# Altium project Miner_8TH.PrjPcb (part 2 of 2)

## Sheet BLOCK8.SchDoc
size A3; SheetNumber: 8; SheetTotal: 12
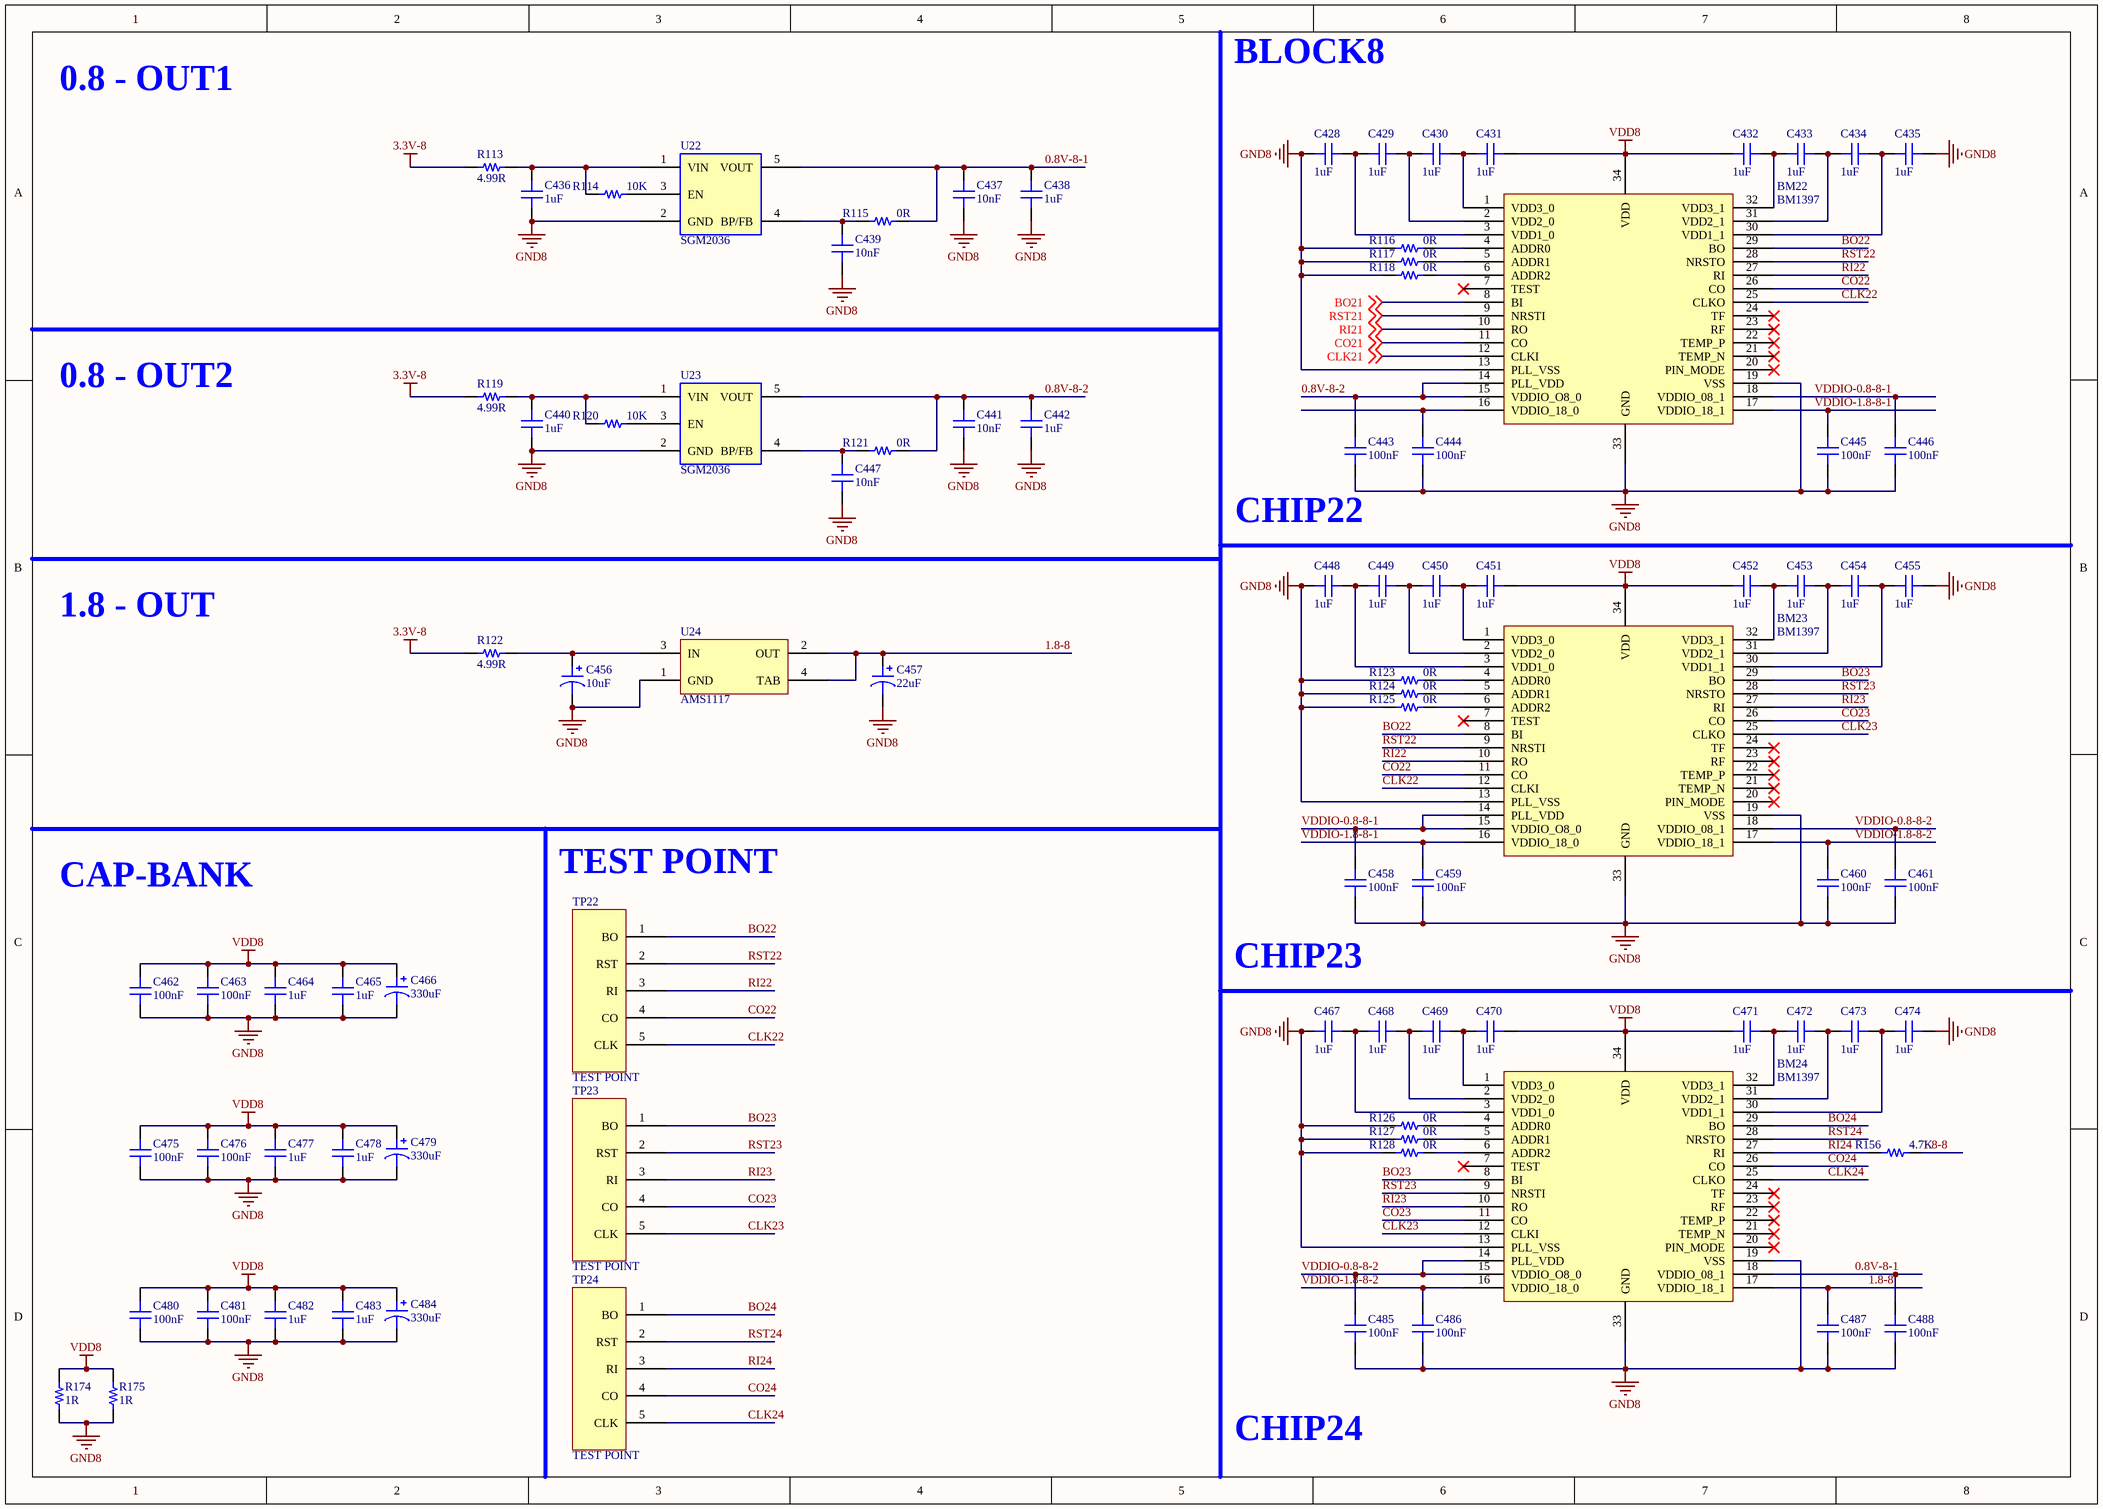
[diagram p7: BLOCK8.SchDoc]

### Parts
BM22  BM1397  [BM1387]
BM23  BM1397  [BM1387]
BM24  BM1397  [BM1387]
C428  1uF  [CAP-SMD-0603]
C429  1uF  [CAP-SMD-0603]
C430  1uF  [CAP-SMD-0603]
C431  1uF  [CAP-SMD-0603]
C432  1uF  [CAP-SMD-0603]
C433  1uF  [CAP-SMD-0603]
C434  1uF  [CAP-SMD-0603]
C435  1uF  [CAP-SMD-0603]
C436  1uF  [CAP_SMD_0805]
C437  10nF  [CAP_SMD_0805]
C438  1uF  [CAP_SMD_0805]
C439  10nF  [CAP_SMD_0805]
C440  1uF  [CAP_SMD_0805]
C441  10nF  [CAP_SMD_0805]
C442  1uF  [CAP_SMD_0805]
C443  100nF  [CAP_SMD_0805]
C444  100nF  [CAP_SMD_0805]
C445  100nF  [CAP_SMD_0805]
C446  100nF  [CAP_SMD_0805]
C447  10nF  [CAP_SMD_0805]
C448  1uF  [CAP-SMD-0603]
C449  1uF  [CAP-SMD-0603]
C450  1uF  [CAP-SMD-0603]
C451  1uF  [CAP-SMD-0603]
C452  1uF  [CAP-SMD-0603]
C453  1uF  [CAP-SMD-0603]
C454  1uF  [CAP-SMD-0603]
C455  1uF  [CAP-SMD-0603]
C456  10uF  [CAP-TAN-CASE-A]
C457  22uF  [CAP-TAN-CASE-A]
C458  100nF  [CAP_SMD_0805]
C459  100nF  [CAP_SMD_0805]
C460  100nF  [CAP_SMD_0805]
C461  100nF  [CAP_SMD_0805]
C462  100nF  [CAP_SMD_0805]
C463  100nF  [CAP_SMD_0805]
C464  1uF  [CAP_SMD_0805]
C465  1uF  [CAP_SMD_0805]
C466  330uF  [CAP-TAN-CASE-E]
C467  1uF  [CAP-SMD-0603]
C468  1uF  [CAP-SMD-0603]
C469  1uF  [CAP-SMD-0603]
C470  1uF  [CAP-SMD-0603]
C471  1uF  [CAP-SMD-0603]
C472  1uF  [CAP-SMD-0603]
C473  1uF  [CAP-SMD-0603]
C474  1uF  [CAP-SMD-0603]
C475  100nF  [CAP_SMD_0805]
C476  100nF  [CAP_SMD_0805]
C477  1uF  [CAP_SMD_0805]
C478  1uF  [CAP_SMD_0805]
C479  330uF  [CAP-TAN-CASE-E]
C480  100nF  [CAP_SMD_0805]
C481  100nF  [CAP_SMD_0805]
C482  1uF  [CAP_SMD_0805]
C483  1uF  [CAP_SMD_0805]
C484  330uF  [CAP-TAN-CASE-E]
C485  100nF  [CAP_SMD_0805]
C486  100nF  [CAP_SMD_0805]
C487  100nF  [CAP_SMD_0805]
C488  100nF  [CAP_SMD_0805]
R113  4.99R  [RES-SMD-1206]
R114  10K  [RES-SMD-0402]
R115  0R  [RES-SMD-0402]
R116  0R  [RES-SMD-0402]
R117  0R  [RES-SMD-0402]
R118  0R  [RES-SMD-0402]
R119  4.99R  [RES-SMD-1206]
R120  10K  [RES-SMD-0402]
R121  0R  [RES-SMD-0402]
R122  4.99R  [RES-SMD-1206]
R123  0R  [RES-SMD-0402]
R124  0R  [RES-SMD-0402]
R125  0R  [RES-SMD-0402]
R126  0R  [RES-SMD-0402]
R127  0R  [RES-SMD-0402]
R128  0R  [RES-SMD-0402]
R156  4.7K  [RES-SMD-0402]
R174  1R  [RES-SMD-1210]
R175  1R  [RES-SMD-1210]
TP22  TEST POINT  [TEST_POINT]
TP23  TEST POINT  [TEST_POINT]
TP24  TEST POINT  [TEST_POINT]
U22  SGM2036  [SOT23-5PIN]
U23  SGM2036  [SOT23-5PIN]
U24  AMS1117  [AMS1117]

### Nets
3.3V-8: R113.1 R119.1 R122.1
GND8: BM22.13(PLL_VSS) BM22.19(VSS) BM22.33(GND) BM23.13(PLL_VSS) BM23.19(VSS) BM23.33(GND) BM24.13(PLL_VSS) BM24.19(VSS) BM24.33(GND) C428.1 C435.2 C436.1 C437.1 C438.1 C439.1 C440.1 C441.1 C442.1 C443.1 C444.1 C445.1 C446.1 C447.1 C448.1 C455.2 C456.2 C457.2 C458.1 C459.1 C460.1 C461.1 C462.1 C463.1 C464.1 C465.1 C466.2 C467.1 C474.2 C475.1 C476.1 C477.1 C478.1 C479.2 C480.1 C481.1 C482.1 C483.1 C484.2 C485.1 C486.1 C487.1 C488.1 R116.1 R117.1 R118.1 R123.1 R124.1 R125.1 R126.1 R127.1 R128.1 R174.1 R175.1 U22.2(GND) U23.2(GND) U24.1(GND)  [project net 3.3V-6]
VDD8: BM22.34(VDD) BM23.34(VDD) BM24.34(VDD) C431.2 C432.1 C451.2 C452.1 C462.2 C463.2 C464.2 C465.2 C466.1 C470.2 C471.1 C475.2 C476.2 C477.2 C478.2 C479.1 C480.2 C481.2 C482.2 C483.2 C484.1 R174.2 R175.2  [project net 12V]
0.8V-8-1: BM24.18(VDDIO_08_1) C437.2 C438.2 C488.2 R115.2 U22.5(VOUT)
0.8V-8-2: BM22.14(PLL_VDD) BM22.15(VDDIO_O8_0) C441.2 C442.2 C443.2 R121.2 U23.5(VOUT)
1.8-8: BM24.17(VDDIO_18_1) C457.1 C487.2 R156.2 U24.2(OUT) U24.4(TAB)
BO21: BM22.8(BI) ; off-sheet BO21
BO22: BM22.29(BO) BM23.8(BI) TP22.1(BO)
BO23: BM23.29(BO) BM24.8(BI) TP23.1(BO)
BO24: BM24.29(BO) TP24.1(BO)
CLK21: BM22.12(CLKI) ; off-sheet CLK21
CLK22: BM22.25(CLKO) BM23.12(CLKI) TP22.5(CLK)
CLK23: BM23.25(CLKO) BM24.12(CLKI) TP23.5(CLK)
CLK24: BM24.25(CLKO) TP24.5(CLK)
CO21: BM22.11(CO) ; off-sheet CO21
CO22: BM22.26(CO) BM23.11(CO) TP22.4(CO)
CO23: BM23.26(CO) BM24.11(CO) TP23.4(CO)
CO24: BM24.26(CO) TP24.4(CO)
RI21: BM22.10(RO) ; off-sheet RI21
RI22: BM22.27(RI) BM23.10(RO) TP22.3(RI)
RI23: BM23.27(RI) BM24.10(RO) TP23.3(RI)
RI24: BM24.27(RI) R156.1 TP24.3(RI)
RST21: BM22.9(NRSTI) ; off-sheet RST21
RST22: BM22.28(NRSTO) BM23.9(NRSTI) TP22.2(RST)
RST23: BM23.28(NRSTO) BM24.9(NRSTI) TP23.2(RST)
RST24: BM24.28(NRSTO) TP24.2(RST)
VDDIO-0.8-8-1: BM22.18(VDDIO_08_1) BM23.14(PLL_VDD) BM23.15(VDDIO_O8_0) C446.2 C458.2
VDDIO-0.8-8-2: BM23.18(VDDIO_08_1) BM24.14(PLL_VDD) BM24.15(VDDIO_O8_0) C461.2 C485.2
VDDIO-1.8-8-1: BM22.17(VDDIO_18_1) BM23.16(VDDIO_18_0) C445.2 C459.2
VDDIO-1.8-8-2: BM23.17(VDDIO_18_1) BM24.16(VDDIO_18_0) C460.2 C486.2
NetBM22_1: BM22.1(VDD3_0) C430.2 C431.1
NetBM22_2: BM22.2(VDD2_0) C429.2 C430.1
NetBM22_3: BM22.3(VDD1_0) C428.2 C429.1
NetBM22_4: BM22.4(ADDR0) R116.2
NetBM22_5: BM22.5(ADDR1) R117.2
NetBM22_6: BM22.6(ADDR2) R118.2
NetBM22_16: BM22.16(VDDIO_18_0) C444.2
NetBM22_30: BM22.30(VDD1_1) C434.2 C435.1
NetBM22_31: BM22.31(VDD2_1) C433.2 C434.1
NetBM22_32: BM22.32(VDD3_1) C432.2 C433.1
NetBM23_1: BM23.1(VDD3_0) C450.2 C451.1
NetBM23_2: BM23.2(VDD2_0) C449.2 C450.1
NetBM23_3: BM23.3(VDD1_0) C448.2 C449.1
NetBM23_4: BM23.4(ADDR0) R123.2
NetBM23_5: BM23.5(ADDR1) R124.2
NetBM23_6: BM23.6(ADDR2) R125.2
NetBM23_30: BM23.30(VDD1_1) C454.2 C455.1
NetBM23_31: BM23.31(VDD2_1) C453.2 C454.1
NetBM23_32: BM23.32(VDD3_1) C452.2 C453.1
NetBM24_1: BM24.1(VDD3_0) C469.2 C470.1
NetBM24_2: BM24.2(VDD2_0) C468.2 C469.1
NetBM24_3: BM24.3(VDD1_0) C467.2 C468.1
NetBM24_4: BM24.4(ADDR0) R126.2
NetBM24_5: BM24.5(ADDR1) R127.2
NetBM24_6: BM24.6(ADDR2) R128.2
NetBM24_30: BM24.30(VDD1_1) C473.2 C474.1
NetBM24_31: BM24.31(VDD2_1) C472.2 C473.1
NetBM24_32: BM24.32(VDD3_1) C471.2 C472.1
NetC436_2: C436.2 R113.2 R114.1 U22.1(VIN)
NetC439_2: C439.2 R115.1 U22.4(BP/FB)
NetC440_2: C440.2 R119.2 R120.1 U23.1(VIN)
NetC447_2: C447.2 R121.1 U23.4(BP/FB)
NetC456_1: C456.1 R122.2 U24.3(IN)
NetR114_2: R114.2 U22.3(EN)
NetR120_2: R120.2 U23.3(EN)

Not connected (* = marked no-connect by the designer): BM22 7(TEST)* 20(PIN_MODE)* 21(TEMP_N)* 22(TEMP_P)* 23(RF)* 24(TF)*; BM23 7(TEST)* 20(PIN_MODE)* 21(TEMP_N)* 22(TEMP_P)* 23(RF)* 24(TF)*; BM24 7(TEST)* 20(PIN_MODE)* 21(TEMP_N)* 22(TEMP_P)* 23(RF)* 24(TF)*

### Notes on the sheet
- 0.8 - OUT1
- BLOCK8
- 0.8 - OUT2
- (near C443) CHIP22
- 1.8 - OUT
- CAP-BANK
- TEST POINT
- CHIP23
- CHIP24

### Library data of the parts
BM22-BM24 = BM1397_1
C428-C455 C458-C465 C467-C478 C480-C483 C485-C488 = CAP
C456 C457 C466 C479 C484 = POLARIZED CAP
R113-R128 R156 R174 R175 = RES

## Sheet Prepheral.SchDoc
size A4; SheetNumber: 9; SheetTotal: 12
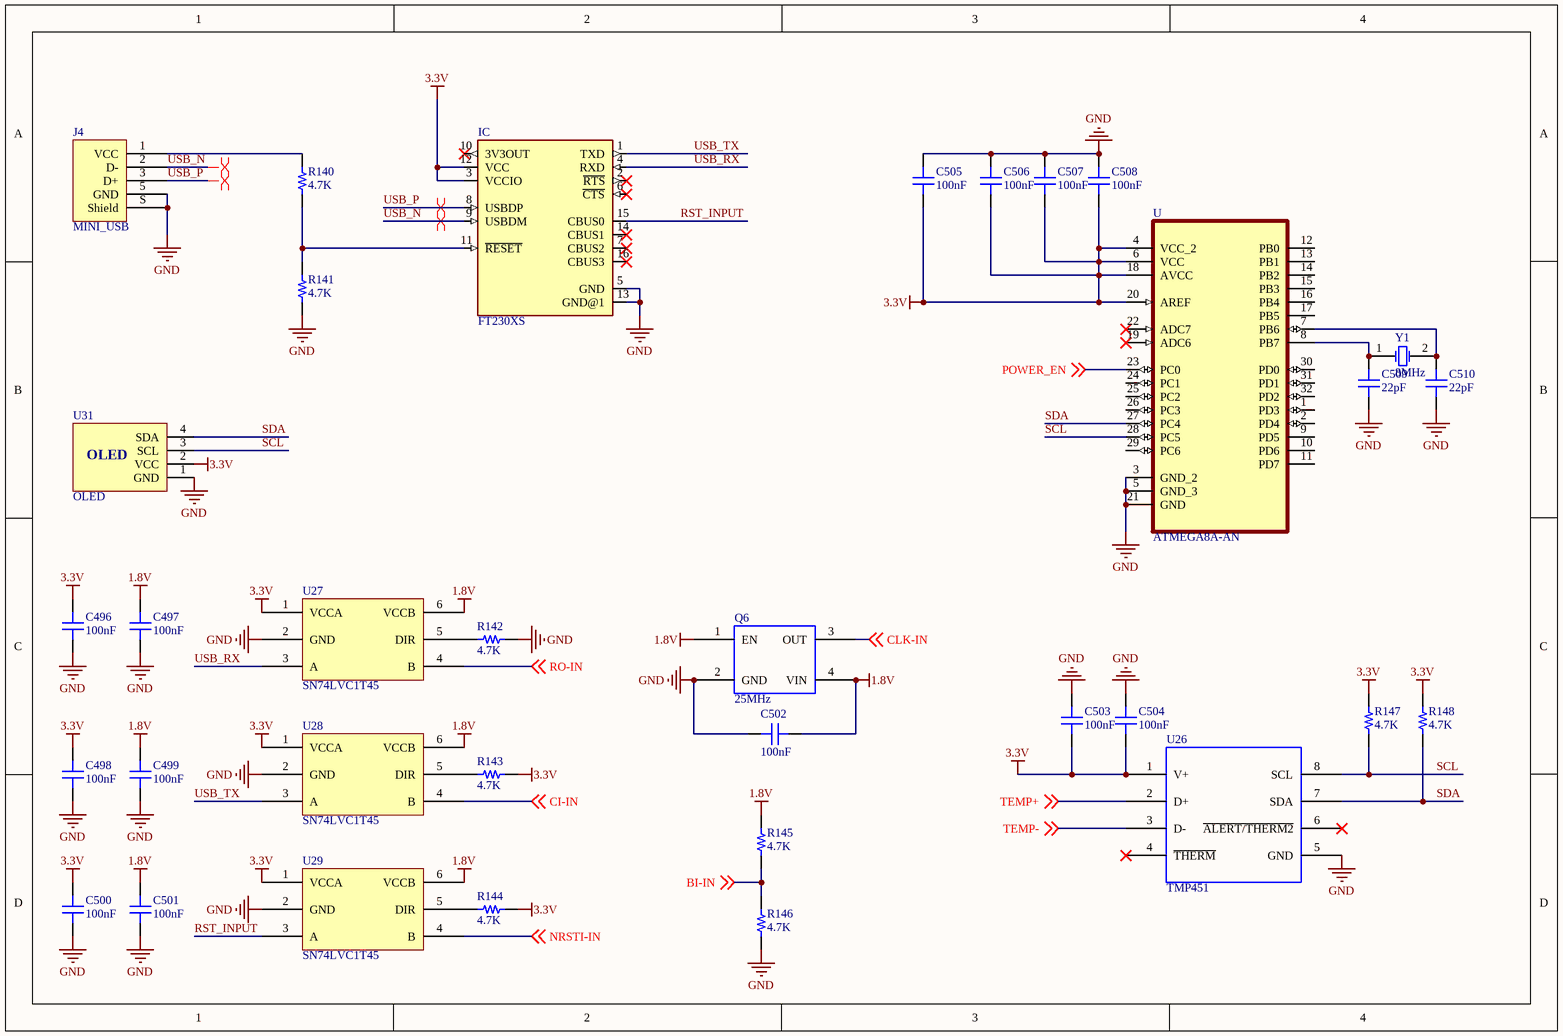
[diagram p8: Prepheral.SchDoc]

### Parts
C496  100nF  [CAP-SMD-0603]
C497  100nF  [CAP-SMD-0603]
C498  100nF  [CAP-SMD-0603]
C499  100nF  [CAP-SMD-0603]
C500  100nF  [CAP-SMD-0603]
C501  100nF  [CAP-SMD-0603]
C502  100nF  [CAP_SMD_0805]
C503  100nF  [CAP_SMD_0805]
C504  100nF  [CAP_SMD_0805]
C505  100nF  [CAP_SMD_0805]
C506  100nF  [CAP_SMD_0805]
C507  100nF  [CAP_SMD_0805]
C508  100nF  [CAP_SMD_0805]
C509  22pF  [CAP_SMD_0805]
C510  22pF  [CAP_SMD_0805]
IC  FT230XS  [SSOP16]
J4  MINI_USB  [Mini_usb]
Q6  25MHz  [XTALL]
R140  4.7K  [RES-SMD-0603]
R141  4.7K  [RES-SMD-0603]
R142  4.7K  [RES-SMD-0603]
R143  4.7K  [RES-SMD-0603]
R144  4.7K  [RES-SMD-0603]
R145  4.7K  [RES-SMD-0603]
R146  4.7K  [RES-SMD-0603]
R147  4.7K  [RES-SMD-0603]
R148  4.7K  [RES-SMD-0603]
U  ATMEGA8A-AN  [QFP80P900X900X120-32N]
U26  TMP451  [SON50P200X200X80-9N]
U27  SN74LVC1T45  [SOT23-6PIN]
U28  SN74LVC1T45  [SOT23-6PIN]
U29  SN74LVC1T45  [SOT23-6PIN]
U31  OLED  [OLED]
Y1  8MHz  [XTAL_SMD]

### Nets
1.8V: C497.2 C499.2 C501.2 C502.2 Q6.1(EN) Q6.4(VIN) R145.1 U27.6(VCCB) U28.6(VCCB) U29.6(VCCB)  [project net 1.8-1]
3.3V: C496.2 C498.2 C500.2 C503.1 C504.1 C505.1 C506.1 C507.1 C508.1 IC.3(VCCIO) IC.12(VCC) R143.1 R144.1 R147.2 R148.2 U.4(VCC_2) U.6(VCC) U.18(AVCC) U.20(AREF) U26.1(V+) U27.1(VCCA) U28.1(VCCA) U29.1(VCCA) U31.2(VCC)
GND: C496.1 C497.1 C498.1 C499.1 C500.1 C501.1 C502.1 C503.2 C504.2 C505.2 C506.2 C507.2 C508.2 C509.1 C510.1 IC.5(GND) IC.13(GND@1) J4.5(GND) J4.S(Shield) Q6.2(GND) R141.1 R142.1 R146.2 U.3(GND_2) U.5(GND_3) U.21(GND) U26.5(GND) U27.2(GND) U28.2(GND) U29.2(GND) U31.1(GND)
BI-IN: R145.2 R146.1 ; off-sheet BI-IN
CI-IN: U28.4(B) ; off-sheet CI-IN
CLK-IN: Q6.3(OUT) ; off-sheet CLK-IN
NRSTI-IN: U29.4(B) ; off-sheet NRSTI-IN
POWER_EN: U.23(PC0) ; off-sheet POWER_EN
RO-IN: U27.4(B) ; off-sheet RO-IN
RST_INPUT: IC.15(CBUS0) U29.3(A)
SCL: R147.1 U.28(PC5) U26.8(SCL) U31.3(SCL)
SDA: R148.1 U.27(PC4) U26.7(SDA) U31.4(SDA)
TEMP+: U26.2(D+) ; off-sheet TEMP+
TEMP-: U26.3(D-) ; off-sheet TEMP-
USB_N: IC.9(USBDM) J4.2(D-)
USB_P: IC.8(USBDP) J4.3(D+)
USB_RX: IC.4(RXD) U27.3(A)
USB_TX: IC.1(TXD) U28.3(A)
NetC509_2: C509.2 U.8(PB7) Y1.1(OSC1)
NetC510_2: C510.2 U.7(PB6) Y1.2(OSC2)
NetIC_11: IC.11(~{RESET}) R140.1 R141.2
NetJ4_1: J4.1(VCC) R140.2
NetR142_2: R142.2 U27.5(DIR)
NetR143_2: R143.2 U28.5(DIR)
NetR144_2: R144.2 U29.5(DIR)

Not connected (* = marked no-connect by the designer): IC 2(~{RTS})* 6(~{CTS})* 7(CBUS2)* 10(3V3OUT)* 14(CBUS1)* 16(CBUS3)*; U 1(PD3) 2(PD4) 9(PD5) 10(PD6) 11(PD7) 12(PB0) 13(PB1) 14(PB2) 15(PB3) 16(PB4) 17(PB5) 19(ADC6)* 22(ADC7)* 24(PC1) 25(PC2) 26(PC3) 29(PC6) 30(PD0) 31(PD1) 32(PD2); U26 4(~{THERM})* 6(~{ALERT/THERM2})*

### Layout directives
differential pair: USB_N, USB_P

### Library data of the parts
C496-C510 = CAP
IC = FT230XS: USB Bridge, USB to UART USB 2.0 UART Interface 16-SSOP; MF: FTDI, Future; MP: FT230XS; Price: None; Availability: Unavailable; Package: SSOP-16 FTDI; SnapEDA_Link: https://www.snapeda.com/parts/FT230XS/FTDI%2C%20Future%20Technology%20Devices%20International%20Ltd/view-part/433817/?ref=snap; Value: *
Q6 = OSCILLATOR
R140-R148 = RES
U = ATMEGA8A-AN: AVR AVRÂ® ATmega Microcontroller IC 8-Bit 16MHz 8KB (4K x 16) FLASH 32-TQFP (7x7); MF: Microchip; SnapEDA_Link: https://www.snapeda.com/parts/ATMEGA8A-AN/Microchip/view-part/883838/?ref=snap; Value: *; MP: ATMEGA8A-AN; DigiKey-Purchase-URL: https://snapeda.com/shop?store=DigiKey&id=883838; Package: TQFP-32 Microchip; Price: None; Availability: Warning; Mouser-Purchase-URL: https://snapeda.com/shop?store=Mouser&id=883838
Y1 = XTAL: Crystal Oscillator; Published: 8-Jun-2000; LatestRevisionDate: 17-Jul-2002; LatestRevisionNote: Re-released for DXP Platform.; PackageReference: R38; Publisher: Altium Limited; PackageDescription: Crystal, Thru-Hole; 2 Leads; Body 3.1 x 8.2 mm (Dia.xH); Value: 8MHz

## Sheet Power.SchDoc
size A4; SheetNumber: 10; SheetTotal: 12
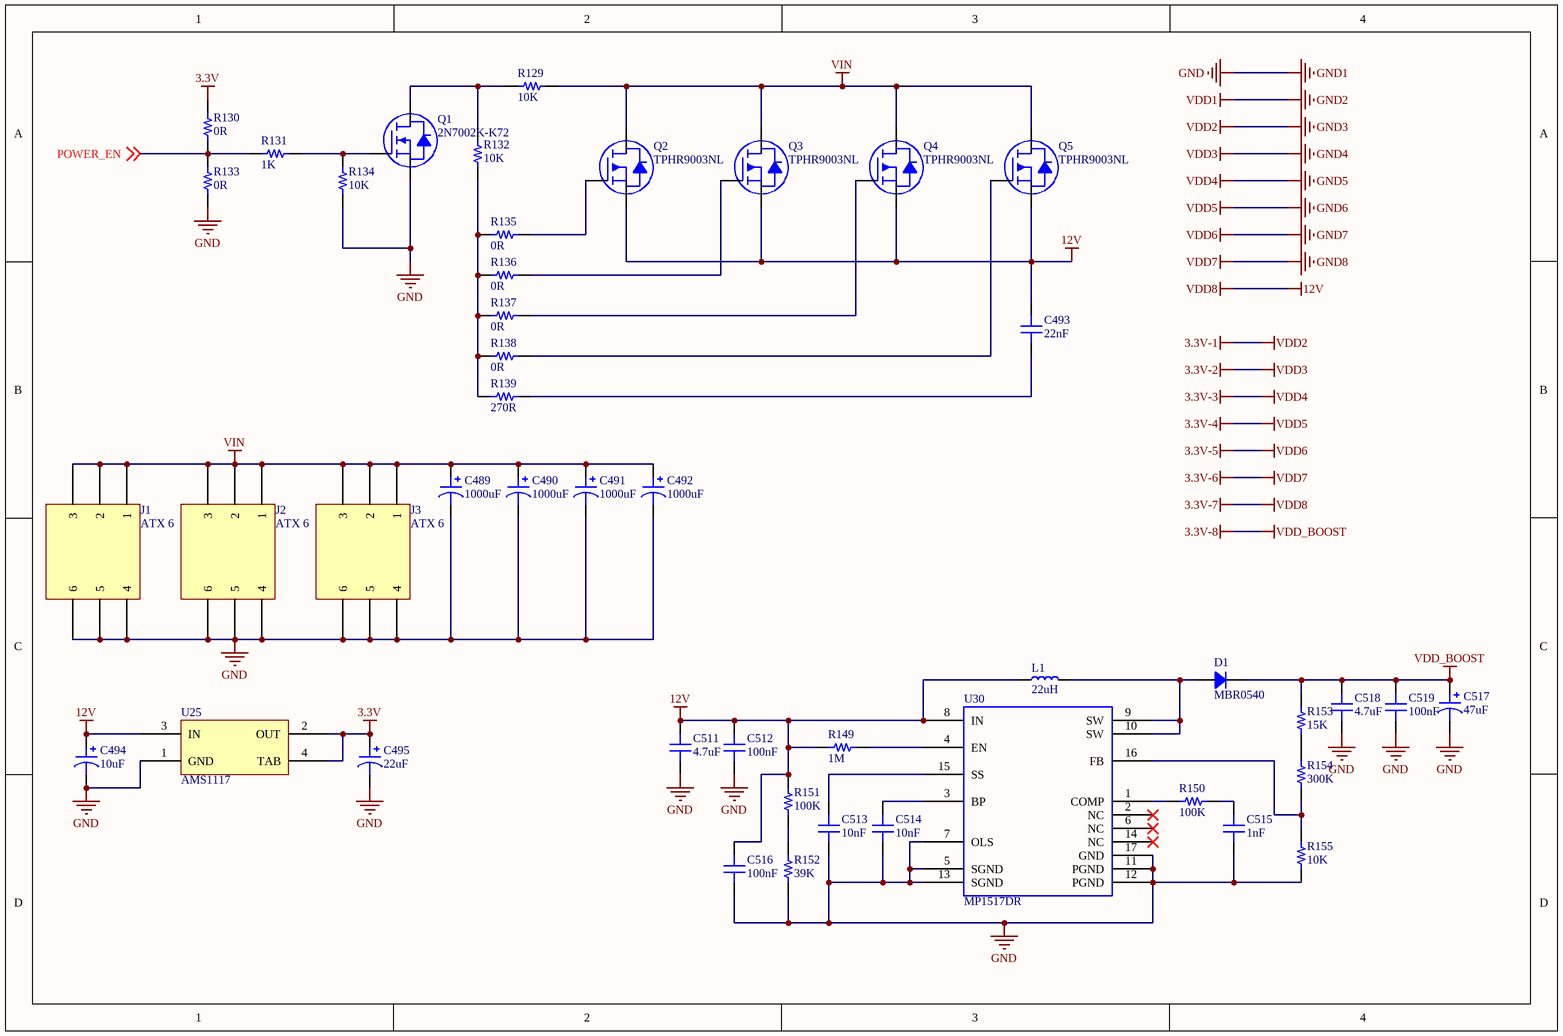
[diagram p9: Power.SchDoc]

### Parts
C489  1000uF  [CAP ALUM 10.3MM]
C490  1000uF  [CAP ALUM 10.3MM]
C491  1000uF  [CAP ALUM 10.3MM]
C492  1000uF  [CAP ALUM 10.3MM]
C493  22nF  [CAP_SMD_0805]
C494  10uF  [CAP-TAN-CASE-A]
C495  22uF  [CAP-TAN-CASE-A]
C511  4.7uF  [CAP_SMD_0805]
C512  100nF  [CAP_SMD_0805]
C513  10nF  [CAP_SMD_0805]
C514  10nF  [CAP_SMD_0805]
C515  1nF  [CAP_SMD_0805]
C516  100nF  [CAP_SMD_0805]
C517  47uF  [CAP ALUM 10.3MM]
C518  4.7uF  [CAP_SMD_0805]
C519  100nF  [CAP_SMD_0805]
D1  MBR0540  [m7]
J1  ATX 6  [ATX 6]
J2  ATX 6  [ATX 6]
J3  ATX 6  [ATX 6]
L1  22uH  [IND]
Q1  2N7002K-K72  [SOT-23_H]
Q2  TPHR9003NL  [ADVANCE SOP]
Q3  TPHR9003NL  [ADVANCE SOP]
Q4  TPHR9003NL  [ADVANCE SOP]
Q5  TPHR9003NL  [ADVANCE SOP]
R129  10K  [RES-SMD-1206]
R130  0R  [RES-SMD-1206]
R131  1K  [RES-SMD-1206]
R132  10K  [RES-SMD-1206]
R133  0R  [RES-SMD-1206]
R134  10K  [RES-SMD-1206]
R135  0R  [RES-SMD-1206]
R136  0R  [RES-SMD-1206]
R137  0R  [RES-SMD-1206]
R138  0R  [RES-SMD-1206]
R139  270R  [RES-SMD-1206]
R149  1M  [RES-SMD-1206]
R150  100K  [RES-SMD-1206]
R151  100K  [RES-SMD-1206]
R152  39K  [RES-SMD-1206]
R153  15K  [RES-SMD-1206]
R154  300K  [RES-SMD-1206]
R155  10K  [RES-SMD-1206]
U25  AMS1117  [AMS1117]
U30  MP1517DR  [QFN80P500X500X80-17N]

### Nets
3.3V: C495.1 R130.2 U25.2(OUT) U25.4(TAB)
3.3V-8: C517.1 C518.2 C519.2 D1.2 R153.1  [also labelled VDD_BOOST]
12V: C493.2 C494.1 C511.2 C512.2 C516.2 L1.1 Q2.D Q3.D Q4.D Q5.D R149.1 R151.2 U25.3(IN) U30.8(IN)  [also labelled 3.3V-7, VDD8]
GND: C489.2 C490.2 C491.2 C492.2 C494.2 C495.2 C511.1 C512.1 C513.1 C514.1 C515.1 C516.1 C517.2 C518.1 C519.1 J1.4 J1.5 J1.6 J2.4 J2.5 J2.6 J3.4 J3.5 J3.6 Q1.2 R133.1 R134.1 R152.1 R155.2 U25.1(GND) U30.5(SGND) U30.7(OLS) U30.11(PGND) U30.12(PGND) U30.13(SGND) U30.17(GND)  [also labelled GND1]
VIN: C489.1 C490.1 C491.1 C492.1 J1.1 J1.2 J1.3 J2.1 J2.2 J2.3 J3.1 J3.2 J3.3 Q2.S Q3.S Q4.S Q5.S R129.2
POWER_EN: R130.1 R131.2 R133.2 ; off-sheet POWER_EN
NetC493_1: C493.1 R139.2
NetC513_2: C513.2 U30.15(SS)
NetC514_2: C514.2 U30.3(BP)
NetC515_2: C515.2 R150.1
NetD1_1: D1.1 L1.2 U30.9(SW) U30.10(SW)
NetQ1_1: Q1.1 R131.1 R134.2
NetQ1_3: Q1.3 R129.1 R132.2
NetQ2_G: Q2.G R135.2
NetQ3_G: Q3.G R136.2
NetQ4_G: Q4.G R137.2
NetQ5_G: Q5.G R138.2
NetR132_1: R132.1 R135.1 R136.1 R137.1 R138.1 R139.1
NetR149_2: R149.2 U30.4(EN)
NetR150_2: R150.2 U30.1(COMP)
NetR151_1: R151.1 R152.2
NetR153_2: R153.2 R154.1
NetR154_2: R154.2 R155.1 U30.16(FB)

Not connected (* = marked no-connect by the designer): U30 2(NC)* 6(NC)* 14(NC)*

### Library data of the parts
C489-C492 C494 C495 C517 = POLARIZED CAP
C493 C511-C516 C518 C519 = CAP
D1 = 1N4007
L1 = INDUCTOR
Q1 = 2N70002
Q2-Q5 = MOSFET-N
R129-R139 R149-R155 = RES
U30 = MP1517

## Sheet OUTPUT.SchDoc
size A4; SheetNumber: 11; SheetTotal: 12
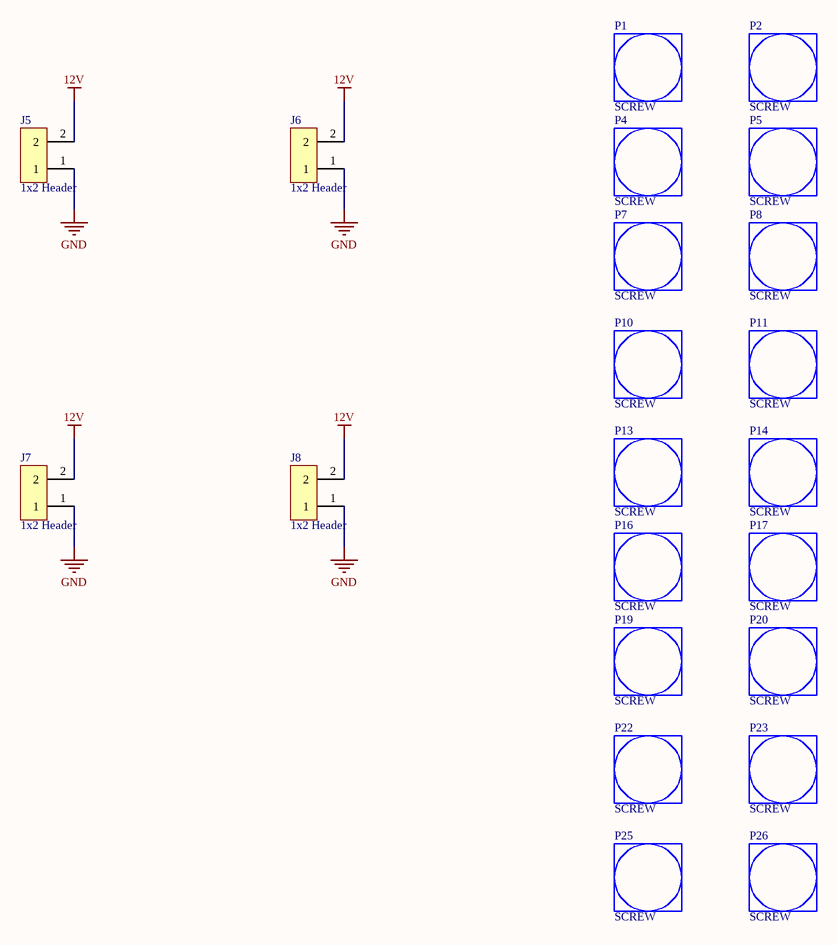
[diagram p10: OUTPUT.SchDoc]

### Parts
J5  1x2 Header  [HDR1*2]
J6  1x2 Header  [HDR1*2]
J7  1x2 Header  [HDR1*2]
J8  1x2 Header  [HDR1*2]
P1  SCREW  [PICH]
P2  SCREW  [PICH]
P4  SCREW  [PICH]
P5  SCREW  [PICH]
P7  SCREW  [PICH]
P8  SCREW  [PICH]
P10  SCREW  [PICH]
P11  SCREW  [PICH]
P13  SCREW  [PICH]
P14  SCREW  [PICH]
P16  SCREW  [PICH]
P17  SCREW  [PICH]
P19  SCREW  [PICH]
P20  SCREW  [PICH]
P22  SCREW  [PICH]
P23  SCREW  [PICH]
P25  SCREW  [PICH]
P26  SCREW  [PICH]

### Nets
12V: J5.2 J6.2 J7.2 J8.2
GND: J5.1 J6.1 J7.1 J8.1

### Library data of the parts
J5-J8 = HDR1*2: Headers & Wire Housings 2 PIN F/LK HEADER; Manufacturer: Molex; Number of Positions: 2; Gender: Male; Contact Resistance: 10mR; Current Rating: 4A; Voltage Rating: 250V; Pitch: 2.54mm; Glow Wire Compliant: Non-compliant; Supplier 1: Digi-Key; Manufacturer Part Number: 22-29-2021; Stock 1: 17589; Pricing 1: 1=0.46, 10=0.431, 100=0.3014, 500=0.2583, 1000=0.21525, 5000=0.1845, 10000=0.1722 (USD); Mount: Through Hole; Housing Colour: White; Colour: White; Housing Material: Nylon; Contact Plating: Gold; Contact Material: Brass; Min Operating Temperature: 0°C; Max Operating Temperature: 75°C; Number of Rows: 1; Packaging: Bulk; Termination: Through Hole; Orientation: Straight; Number of Contacts: 2; Package Quantity: 2500; Number of Circuits: 2; Max Current Rating: 4A; Max Voltage Rating (AC): 250V; Voltage Rating (DC): 250V; Length: 12.7mm; Height: 11.7mm; Depth: 5.8mm; Radiation Hardening: No; Lead Free: Lead Free; REACH SVHC: Unknown; Halogen Free: Low Halogen; Flammability Rating: UL94 V-0; ComponentLink1URL: https://datasheet.ciiva.com/30169/113840022292021-pcb-headers-30169888.pdf; ComponentLink1Description: https://datasheet.ciiva.com/30169/113840022292021-pcb-headers-30169888.pdf; ComponentLink2URL: https://datasheet.ciiva.com/19472/879588-19472951.pdf; ComponentLink2Description: https://datasheet.ciiva.com/19472/879588-19472951.pdf; ComponentLink3URL: https://datasheet.ciiva.com/11752/0900766b80d5fb7a-11752634.pdf; ComponentLink3Description: https://datasheet.ciiva.com/11752/0900766b80d5fb7a-11752634.pdf; ComponentLink4URL: https://datasheet.ciiva.com/5153/0022292021-pcb-headers-159390-5153053.pdf; ComponentLink4Description: https://datasheet.ciiva.com/5153/0022292021-pcb-headers-159390-5153053.pdf; ComponentLink5URL: https://datasheet.ciiva.com/9468/0022292021-pcb-headers-9468301.pdf; ComponentLink5Description: https://datasheet.ciiva.com/9468/0022292021-pcb-headers-9468301.pdf; ComponentLink6URL: https://datasheet.ciiva.com/25908/0022292021-pcb-headers-25908286.pdf; ComponentLink6Description: https://datasheet.ciiva.com/25908/0022292021-pcb-headers-25908286.pdf; Supplier Part Number 1: WM2744-ND; Category: Connectors
P1 P2 P4 P5 P7 P8 P10 P11 P13 P14 P16 P17 P19 P20 P22 P23 P25 P26 = PICH

## Sheet HEAT_SINK.SchDoc
size A4; SheetNumber: 12; SheetTotal: 12
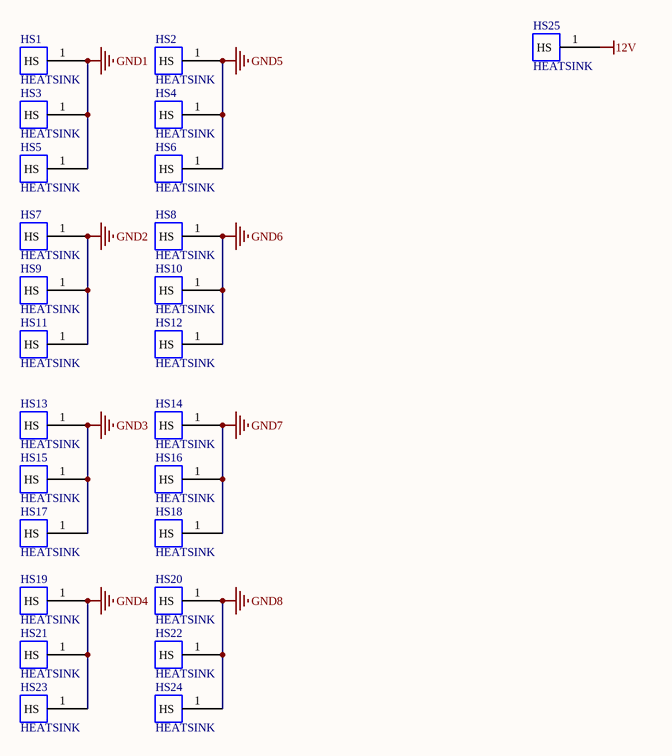
[diagram p11: HEAT_SINK.SchDoc]

### Parts
HS1  HEATSINK  [HEAT_SINK]
HS2  HEATSINK  [HEAT_SINK]
HS3  HEATSINK  [HEAT_SINK]
HS4  HEATSINK  [HEAT_SINK]
HS5  HEATSINK  [HEAT_SINK]
HS6  HEATSINK  [HEAT_SINK]
HS7  HEATSINK  [HEAT_SINK]
HS8  HEATSINK  [HEAT_SINK]
HS9  HEATSINK  [HEAT_SINK]
HS10  HEATSINK  [HEAT_SINK]
HS11  HEATSINK  [HEAT_SINK]
HS12  HEATSINK  [HEAT_SINK]
HS13  HEATSINK  [HEAT_SINK]
HS14  HEATSINK  [HEAT_SINK]
HS15  HEATSINK  [HEAT_SINK]
HS16  HEATSINK  [HEAT_SINK]
HS17  HEATSINK  [HEAT_SINK]
HS18  HEATSINK  [HEAT_SINK]
HS19  HEATSINK  [HEAT_SINK]
HS20  HEATSINK  [HEAT_SINK]
HS21  HEATSINK  [HEAT_SINK]
HS22  HEATSINK  [HEAT_SINK]
HS23  HEATSINK  [HEAT_SINK]
HS24  HEATSINK  [HEAT_SINK]
HS25  HEATSINK  [HEAT_SINK]

### Nets
12V: HS25.1(HS)
GND1: HS1.1(HS) HS3.1(HS) HS5.1(HS)  [project net GND]
GND2: HS7.1(HS) HS9.1(HS) HS11.1(HS)
GND3: HS13.1(HS) HS15.1(HS) HS17.1(HS)  [project net 3.3V-1]
GND4: HS19.1(HS) HS21.1(HS) HS23.1(HS)  [project net 3.3V-2]
GND5: HS2.1(HS) HS4.1(HS) HS6.1(HS)  [project net 3.3V-3]
GND6: HS8.1(HS) HS10.1(HS) HS12.1(HS)  [project net 3.3V-4]
GND7: HS14.1(HS) HS16.1(HS) HS18.1(HS)  [project net 3.3V-5]
GND8: HS20.1(HS) HS22.1(HS) HS24.1(HS)  [project net 3.3V-6]

### Library data of the parts
HS1-HS25 = HEAT_SINK

## Nets that join several sheets
1.8-1: BLOCK1 (5 pins), Prepheral (10 pins)
3.3V: Prepheral (24 pins), Power (C495.1 R130.2 U25.2 U25.4)
3.3V-1: BLOCK1 (R10.1 R13.1 R16.1), BLOCK2 (26 pins), BLOCK3 (69 pins), HEAT_SINK (HS13.1 HS15.1 HS17.1)
3.3V-2: BLOCK2 (R17.1 R23.1 R26.1), BLOCK3 (26 pins), BLOCK4 (66 pins), HEAT_SINK (HS19.1 HS21.1 HS23.1)
3.3V-3: BLOCK3 (R33.1 R39.1 R42.1), BLOCK4 (26 pins), BLOCK5 (69 pins), HEAT_SINK (HS2.1 HS4.1 HS6.1)
3.3V-4: BLOCK4 (R49.1 R55.1 R58.1), BLOCK5 (26 pins), BLOCK6 (66 pins), HEAT_SINK (HS8.1 HS10.1 HS12.1)
3.3V-5: BLOCK5 (R65.1 R71.1 R74.1), BLOCK6 (26 pins), BLOCK7 (69 pins), HEAT_SINK (HS14.1 HS16.1 HS18.1)
3.3V-6: BLOCK6 (R81.1 R87.1 R90.1), BLOCK7 (26 pins), BLOCK8 (66 pins), HEAT_SINK (HS20.1 HS22.1 HS24.1)
3.3V-8: BLOCK8 (R113.1 R119.1 R122.1), Power (5 pins)
12V: BLOCK7 (R97.1 R103.1 R106.1), BLOCK8 (26 pins), Power (14 pins), OUTPUT (J5.2 J6.2 J7.2 J8.2), HEAT_SINK (HS25.1)
GND: BLOCK1 (69 pins), Prepheral (31 pins), Power (36 pins), OUTPUT (J5.1 J6.1 J7.1 J8.1), HEAT_SINK (HS1.1 HS3.1 HS5.1)
GND2: BLOCK1 (26 pins), BLOCK2 (66 pins), HEAT_SINK (HS7.1 HS9.1 HS11.1)
BI-IN: BLOCK1 (BM1.25), Prepheral (R145.2 R146.1)
BO3: BLOCK1 (BM3.12 TP3.1), BLOCK2 (BM4.8)
BO6: BLOCK2 (BM6.29 TP6.1), BLOCK3 (BM7.25)
BO9: BLOCK3 (BM9.12 TP9.1), BLOCK4 (BM10.8)
BO12: BLOCK4 (BM12.29 TP12.1), BLOCK5 (BM13.25)
BO15: BLOCK5 (BM15.12 TP15.1), BLOCK6 (BM16.8)
BO18: BLOCK6 (BM18.29 TP18.1), BLOCK7 (BM19.25)
BO21: BLOCK7 (BM21.12 TP21.1), BLOCK8 (BM22.8)
CI-IN: BLOCK1 (BM1.28), Prepheral (U28.4)
CLK3: BLOCK1 (BM3.8 TP3.5), BLOCK2 (BM4.12)
CLK6: BLOCK2 (BM6.25 TP6.5), BLOCK3 (BM7.29)
CLK9: BLOCK3 (BM9.8 TP9.5), BLOCK4 (BM10.12)
CLK12: BLOCK4 (BM12.25 TP12.5), BLOCK5 (BM13.29)
CLK15: BLOCK5 (BM15.8 TP15.5), BLOCK6 (BM16.12)
CLK18: BLOCK6 (BM18.25 TP18.5), BLOCK7 (BM19.29)
CLK21: BLOCK7 (BM21.8 TP21.5), BLOCK8 (BM22.12)
CLK-IN: BLOCK1 (BM1.29), Prepheral (Q6.3)
CO3: BLOCK1 (BM3.9 TP3.4), BLOCK2 (BM4.11)
CO6: BLOCK2 (BM6.26 TP6.4), BLOCK3 (BM7.28)
CO9: BLOCK3 (BM9.9 TP9.4), BLOCK4 (BM10.11)
CO12: BLOCK4 (BM12.26 TP12.4), BLOCK5 (BM13.28)
CO15: BLOCK5 (BM15.9 TP15.4), BLOCK6 (BM16.11)
CO18: BLOCK6 (BM18.26 TP18.4), BLOCK7 (BM19.28)
CO21: BLOCK7 (BM21.9 TP21.4), BLOCK8 (BM22.11)
NRSTI-IN: BLOCK1 (BM1.26), Prepheral (U29.4)
POWER_EN: Prepheral (U.23), Power (R130.1 R131.2 R133.2)
RI3: BLOCK1 (BM3.10 TP3.3), BLOCK2 (BM4.10)
RI6: BLOCK2 (BM6.27 TP6.3), BLOCK3 (BM7.27)
RI9: BLOCK3 (BM9.10 TP9.3), BLOCK4 (BM10.10)
RI12: BLOCK4 (BM12.27 TP12.3), BLOCK5 (BM13.27)
RI15: BLOCK5 (BM15.10 TP15.3), BLOCK6 (BM16.10)
RI18: BLOCK6 (BM18.27 TP18.3), BLOCK7 (BM19.27)
RI21: BLOCK7 (BM21.10 TP21.3), BLOCK8 (BM22.10)
RO-IN: BLOCK1 (BM1.27), Prepheral (U27.4)
RST3: BLOCK1 (BM3.11 TP3.2), BLOCK2 (BM4.9)
RST6: BLOCK2 (BM6.28 TP6.2), BLOCK3 (BM7.26)
RST9: BLOCK3 (BM9.11 TP9.2), BLOCK4 (BM10.9)
RST12: BLOCK4 (BM12.28 TP12.2), BLOCK5 (BM13.26)
RST15: BLOCK5 (BM15.11 TP15.2), BLOCK6 (BM16.9)
RST18: BLOCK6 (BM18.28 TP18.2), BLOCK7 (BM19.26)
RST21: BLOCK7 (BM21.11 TP21.2), BLOCK8 (BM22.9)
TEMP+: BLOCK1 (BM1.22), Prepheral (U26.2)
TEMP-: BLOCK1 (BM1.21), Prepheral (U26.3)